# EasyEDA Pro project ProPrj_CH32V003-MAX4466_2025-10-29.epro

# Schematic Schematic1
Board Name: Board1; Create Date: 2025-10-22; Page Name: P1; Project Name: CH32V003-MAX4466; Schematic Name: Schematic1; Update Date: 2025-10-22; Company: 嘉立创EDA; Page Size: A4; Version: V1.0
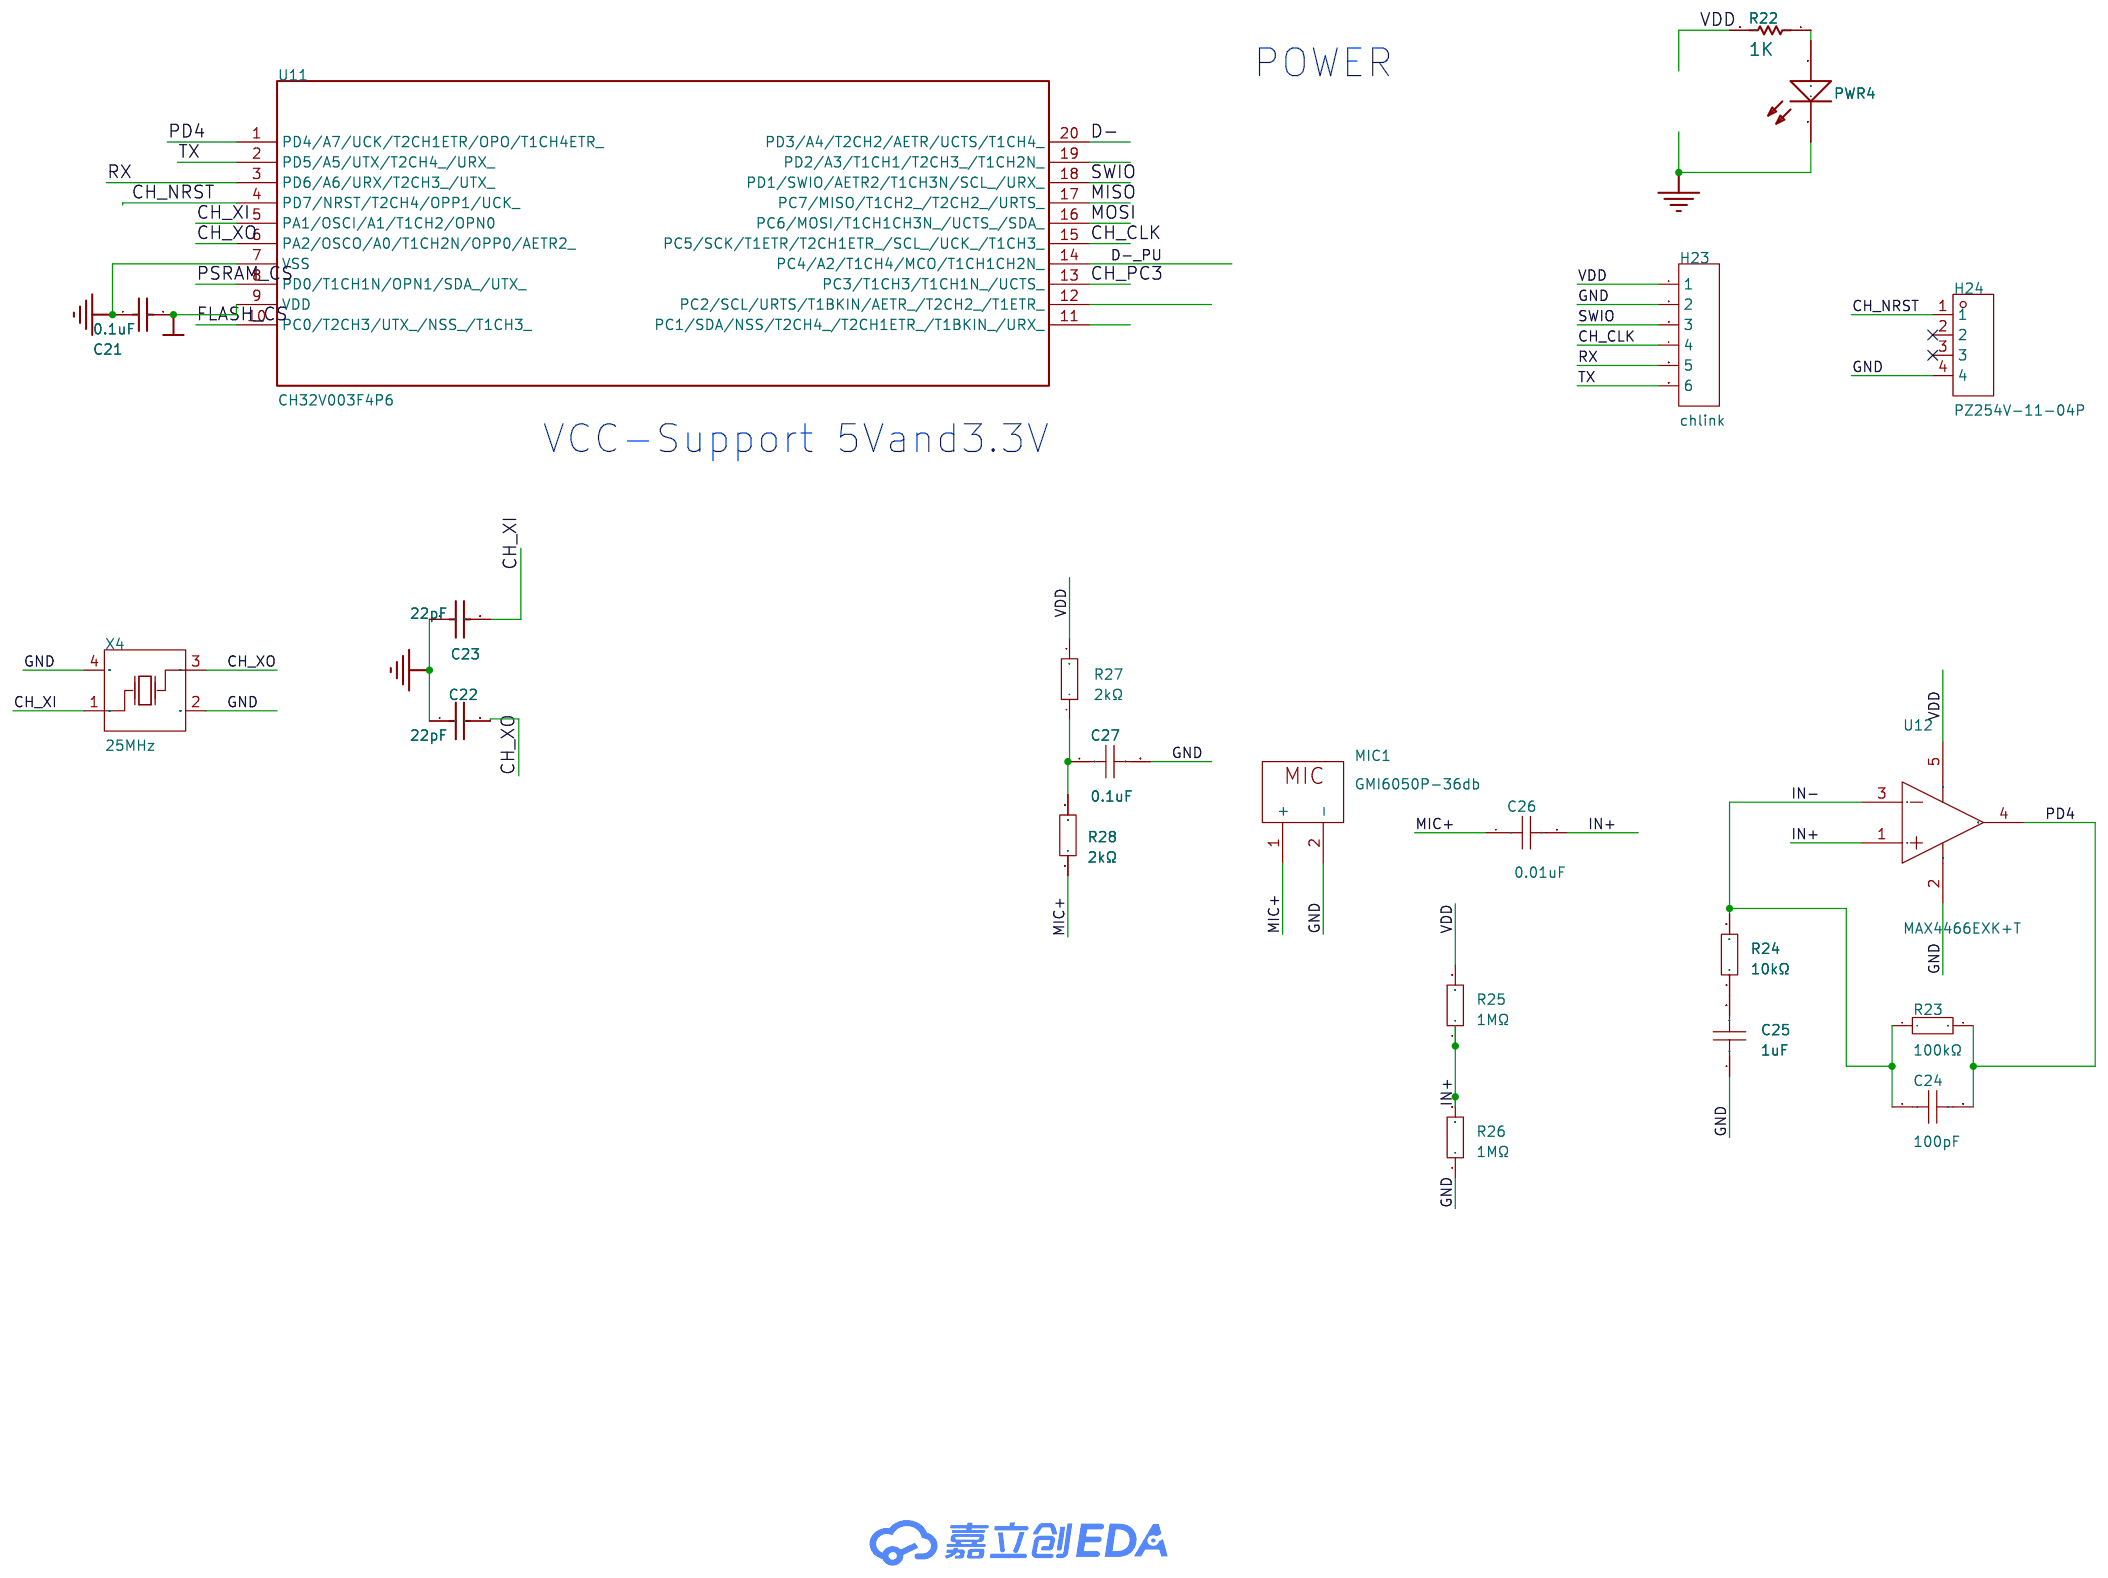
[diagram p0: schematic sheet]

## Parts
C21  15pF  [0603_C]
C22  22pF  [0603_C]
C23  22pF  [0603_C]
C24  100pF  [C0805]
C25  1uF  [C0805]
C26  0.01uF  [C0805]
C27  0.1uF  [C0805]
H23  chlink  [HDR-TH_6P-P2.54-V-M-1]
H24  PZ254V-11-04P  [HDR-TH_4P-P2.54-V-M]
MIC1  GMI6050P-36db  [MIC-TH_BD6.0-P1.90-D0.4-L-FD_GMI6050P-2CXXDB]
PWR4  POWER  red  [0603+]
R22  1K  [0603]
R23  100kΩ  [R0805]
R24  10kΩ  [R0805]
R25  1MΩ  [R0805]
R26  1MΩ  [R0805]
R27  2kΩ  [R0805]
R28  2kΩ  [R0805]
U11  CH32V003F4P6  [TSSOP-20_L6.5-W4.4-P0.65-LS6.4-BL]
U12  MAX4466EXK+T  [SC-70-5_L2.0-W1.3-P0.65-LS2.1-BR]
X4  25MHz  [CRYSTAL-SMD_4P-L3.2-W2.5-BL]

## Library data of the parts
C21 = 0.1uF: Capacitor; Published: 8-Jun-2000; LatestRevisionDate: 17-Jul-2002; LatestRevisionNote: Re-released for DXP Platform.; PackageReference: RAD-0.3; Publisher: Altium Limited; Design Item ID: Cap; Library Name: *
C22 C23 = 22pF: Capacitor; Design Item ID: CAP; Library Name: *
C24-C27 = CL21A106KAYNNNE_C15850: 容值:10uF;精度:±10%;额定电压:25V;温度系数:X5R;; LCSC Part Name: 10uF ±10% 25V; Supplier Part: C15850; Manufacturer: SAMSUNG(三星); Manufacturer Part: CL21A106KAYNNNE; Supplier Footprint: 0805; JLCPCB Part Class: 基础库; Datasheet: https://item.szlcsc.com/datasheet/CL21A106KAYNNNE/16532.html; Supplier: LCSC; Tolerance: ±10%; Voltage Rating: 25V; Temperature Coefficient: X5R
H23 = 2.54-1x6P直针: 插针结构:1x6P;间距:2.54mm;行距:-;圆针/方针:方针;安装方式:直插;排数:单排;总PIN位数:6P;额定电流:3A;额定电压:-;配合针长度:-;塑高:-;触头材质:黄铜;触头镀层:-;工作温度:-40℃~+105℃;颜色:黑色;; LCSC Part Name: 1x6P 间距:2.54mm 方针 直插; Supplier Part: C37208; Manufacturer: BOOMELE(博穆精密); Supplier Footprint: 插件,P=2.54mm; JLCPCB Part Class: 扩展库; Datasheet: https://atta.szlcsc.com/upload/public/pdf/source/20250115/42A019761A40C8B839643401D8CA5A96.pdf; Supplier: LCSC; Pin Structure: 1x6P; Pitch: 2.54mm; Circluar Pins/Square Pins: 方针; Mounting Type: 直插; Number of Rows: 单排; Number of Pins: 6P; Current Rating: 3A; Contact Material: 黄铜; Operating Temperature: -40℃~+105℃; Color: 黑色
H24 = PZ254V-11-04P: 插针结构:1x4P;间距:2.54mm;行距:-;圆针/方针:方针;安装方式:直插;排数:单排;总PIN位数:4P;额定电流:3A;额定电压:250V;配合针长度:6mm;塑高:2.5mm;端接针长度:3mm;触头材质:-;工作温度:-40℃~+105℃;颜色:黑色;; LCSC Part Name: 1x4P 间距:2.54mm 方针 直插; Supplier Part: C2691448; Manufacturer: XFCN(兴飞); Supplier Footprint: 插件,P=2.54mm; JLCPCB Part Class: 扩展库; Datasheet: https://item.szlcsc.com/datasheet/PZ254V-11-04P/2801085.html; Supplier: LCSC; Pin Structure: 1x4P; Pitch: 2.54mm; Circluar Pins/Square Pins: 方针; Mounting Type: 直插; Number of Rows: 单排; Number of Pins: 4P; Current Rating: 3A; Voltage Rating (Max): 250V; Length of Mating Pin: 6mm; Insulation Height: 2.5mm; Length of End Connection Pin: 3mm; Operating Temperature: -40℃~+105℃; Color: 黑色
MIC1 = GMI6050P-36db: LCSC Part Name: 全指向φ6.0*5.0mm 1.5V-10V 灵敏度-36db 低阻抗 针脚; Supplier Part: C233939; Manufacturer: INGHAi(赢海); Supplier Footprint: 插件,D=6mm; JLCPCB Part Class: 扩展库; Datasheet: https://atta.szlcsc.com/upload/public/pdf/source/20180613/C233951_CF3F103FE3546E5F8FCD1BC0597FF08F.pdf; Supplier: LCSC
PWR4 = POWER  red: Typical INFRARED GaAs LED; Published: 8-Jun-2000; LatestRevisionDate: 08-Jul-2005; LatestRevisionNote: Mech Layer 1 removed.; PackageReference: LED-0; Publisher: Altium Limited; Design Item ID: LED0; Library Name: *
R22 = 1K: Semiconductor Resistor; Published: 8-Jun-2000; LatestRevisionDate: 17-Jul-2002; LatestRevisionNote: Re-released for DXP Platform.; PackageReference: AXIAL-0.5; Publisher: Altium Limited; Origin Footprint 2: 1005[0402]; Origin Footprint 3: 1608[0603]; Origin Footprint 4: 2012[0805]; Design Item ID: Res Semi; Library Name: *
R23-R28 = 0805W8F1002T5E_C17414: 电阻类型:厚膜电阻;阻值:10kΩ;精度:±1%;功率:125mW;工作电压:150V;温度系数:±100ppm/℃;; LCSC Part Name: 10kΩ ±1% 125mW 厚膜电阻; Supplier Part: C17414; Manufacturer: UNI-ROYAL(厚声); Manufacturer Part: 0805W8F1002T5E; Supplier Footprint: 0805; JLCPCB Part Class: 基础库; Datasheet: https://atta.szlcsc.com/upload/public/pdf/source/20200306/C422600_1E6D84923E4A46A82E41ADD87F860B5C.pdf; Supplier: LCSC; Type: 厚膜电阻; Tolerance: ±1%; Power(Watts): 125mW; Voltage-Supply(Max): 150V; Temperature Coefficient: ±100ppm/℃; Operating Temperature: -55℃~+155℃
U11 = CH32V003F4P6: LCSC Part Name: QingKe V2微处理器; Supplier Part: C5187096; Manufacturer: WCH(南京沁恒); Supplier Footprint: TSSOP-20-175mil; JLCPCB Part Class: Extended Part; Datasheet: https://item.szlcsc.com/datasheet/CH32V003F4P6/5858783.html; Supplier: LCSC
U12 = MAX4466EXK+T: 功放类型:-;扬声器通道数:单声道;输出功率:-;静态电流(Iq):-;; LCSC Part Name: 低成本、微功耗、SC70/SOT23-8封装、麦克风前置放大器，可完全关断; Supplier Part: C7456762; Manufacturer: ADI(亚德诺)/MAXIM(美信); Supplier Footprint: SC-70-5; JLCPCB Part Class: 扩展库; Datasheet: https://item.szlcsc.com/datasheet/MAX4466EXK%252BT/8482791.html; Supplier: LCSC; Speaker Channels: 单声道; Voltage - Supply: 2.4V~5.5V; Operating Temperature: -40℃~+85℃
X4 = X322525MOB4SI: 晶振类型:贴片晶振;频率:25MHz;常温频差:±10ppm;负载电容:12pF;频率稳定度:±20ppm;; LCSC Part Name: YSX321SL 25MHZ 4P 3225 12PF ±10PPM -40~85℃ (±20PPM); Supplier Part: C9006; Manufacturer: YXC(扬兴晶振); Supplier Footprint: SMD3225-4P; JLCPCB Part Class: 基础库; Datasheet: https://atta.szlcsc.com/upload/public/pdf/source/20240329/19D5F850207469550BEB00D7DFEDBC7A.pdf; Supplier: LCSC; Type: 贴片晶振; Normal temperature Frequency Tolerance: ±10ppm; Load Capacitance: 12pF; Frequency Stability: ±20ppm; Operating Temperature: -40℃~+85℃

## Nets
GND: C21.1 C22.1 C23.1 C25.1 C27.2 H23.2 H24.4 MIC1.2(-) PWR4.2(K) R26.1 U11.7(VSS) U12.2(GND) X4.2(GND) X4.4(GND)
VDD: C21.2 H23.1 R22.2 R25.2 R27.2 U11.9(VDD) U12.5(VCC)
CH_CLK: H23.4 U11.15(PC5/SCK/T1ETR/T2CH1ETR_/SCL_/UCK_/T1CH3_)
CH_NRST: H24.1 U11.4(PD7/NRST/T2CH4/OPP1/UCK_)
CH_PC3: U11.13(PC3/T1CH3/T1CH1N_/UCTS_)
CH_XI: C23.2 U11.5(PA1/OSCI/A1/T1CH2/OPN0) X4.1(OSC1)
CH_XO: C22.2 U11.6(PA2/OSCO/A0/T1CH2N/OPP0/AETR2_) X4.3(OSC2)
D-: U11.20(PD3/A4/T2CH2/AETR/UCTS/T1CH4_)
D-_PU: U11.14(PC4/A2/T1CH4/MCO/T1CH1CH2N_)
FLASH_CS: U11.10(PC0/T2CH3/UTX_/NSS_/T1CH3_)
IN+: C26.2 R25.1 R26.2 U12.1(IN+)
IN-: C24.1 R23.1 R24.2 U12.3(IN-)
MIC+: C26.1 MIC1.1(+) R28.1
MISO: U11.17(PC7/MISO/T1CH2_/T2CH2_/URTS_)
MOSI: U11.16(PC6/MOSI/T1CH1CH3N_/UCTS_/SDA_)
PD4: C24.2 R23.2 U11.1(PD4/A7/UCK/T2CH1ETR/OPO/T1CH4ETR_) U12.4(OUT)
PSRAM_CS: U11.8(PD0/T1CH1N/OPN1/SDA_/UTX_)
RX: H23.5 U11.3(PD6/A6/URX/T2CH3_/UTX_)
SWIO: H23.3 U11.18(PD1/SWIO/AETR2/T1CH3N/SCL_/URX_)
TX: H23.6 U11.2(PD5/A5/UTX/T2CH4_/URX_)
$1N756: PWR4.1(A) R22.1
$1N1311: C25.2 R24.1
$1N1385: C27.1 R27.1 R28.2

Not connected (* = marked no-connect by the designer): H24 2* 3*; U11 11(PC1/SDA/NSS/T2CH4_/T2CH1ETR_/T1BKIN_/URX_) 12(PC2/SCL/URTS/T1BKIN/AETR_/T2CH2_/T1ETR_) 19(PD2/A3/T1CH1/T2CH3_/T1CH2N_)

## Notes on the sheet
- POWER
- VCC-Support 5Vand3.3V

# Board PCB1
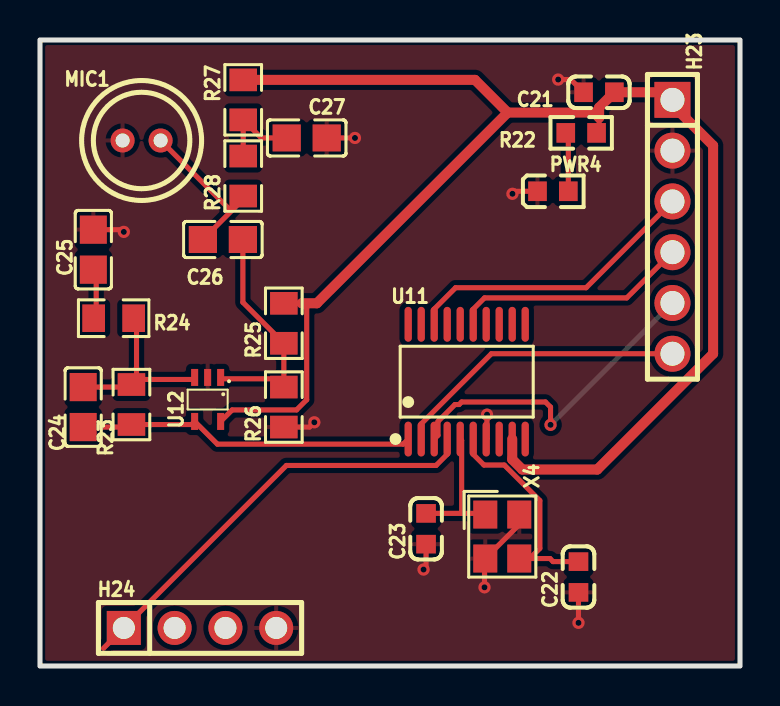
[diagram p1: board, top side]
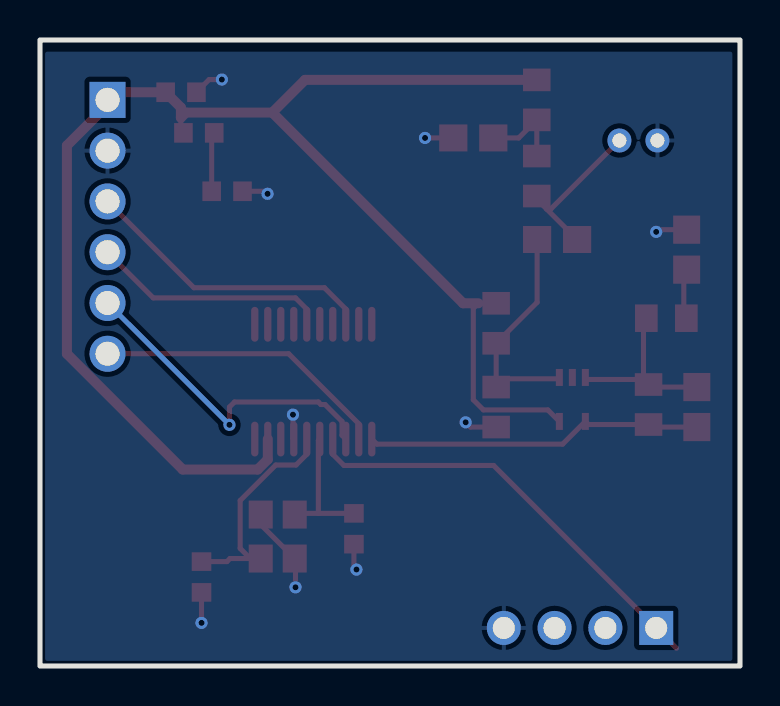
[diagram p2: board, bottom side, seen from below]

Outline 35 x 31.32 mm; copper layers: Top Layer, Bottom Layer. Coordinates in mm from the lower left corner of the outline.
Outline path: rectangle 0,31.32 35,0
Stack: Top Layer 0.035mm / Dielectric1 1.51mm FR4 er 4.5 / Bottom Layer 0.035mm

## Design rules (mm)
template: JLCPCB Capability(Two Layers Board)
spacing copperThickness1oz (default): track to track 0.102, other pairs 0.152 to 0.3
spacing copperThickness2oz: track to track 0.203, other pairs 0.152 to 0.3
track width copperThickness1oz (default): min 0.127, default 0.254, max 2.54
track width copperThickness2oz: min 0.203, default 0.254, max 2.54
differential pair differentialPair (default): width min 0.127, default 0.254, max 2.54; gap min 0.152, default 0.152
via viaSize (default): diameter min 0.5, default 0.61, max 10; hole min 0.3, default 0.305, max 6.3

## Placement (name value [footprint] x y rotation side)
C21  15pF  [0603_C]  27.18 28.7 0 top
C22  22pF  [0603_C]  26.92 3.68 90 top
C23  22pF  [0603_C]  19.3 6.1 90 top
C24  100pF  [C0805]  2.16 12.95 270 top
C25  1uF  [C0805]  2.67 20.83 270 top
C26  0.01uF  [C0805]  9.14 21.34 0 top
C27  0.1uF  [C0805]  13.33 26.42 0 top
H23  chlink  [HDR-TH_6P-P2.54-V-M-1]  31.62 21.97 270 top
H24  PZ254V-11-04P  [HDR-TH_4P-P2.54-V-M]  8 1.91 0 top
MIC1  GMI6050P-36db  [MIC-TH_BD6.0-P1.90-D0.4-L-FD_GMI6050P-2CXXDB]  5.08 26.29 180 top
PWR4  POWER  red  [0603+]  26.42 23.75 180 top
R22  1K  [0603]  26.29 26.67 0 top
R23  100kΩ  [R0805]  4.57 13.08 270 top
R24  10kΩ  [R0805]  3.68 17.4 0 top
R25  1MΩ  [R0805]  12.19 17.15 90 top
R26  1MΩ  [R0805]  12.19 12.95 90 top
R27  2kΩ  [R0805]  10.16 28.32 90 top
R28  2kΩ  [R0805]  10.16 24.51 90 top
U11  CH32V003F4P6  [TSSOP-20_L6.5-W4.4-P0.65-LS6.4-BL]  21.34 14.22 0 top
U12  MAX4466EXK+T  [SC-70-5_L2.0-W1.3-P0.65-LS2.1-BR]  8.38 13.34 90 top
X4  25MHz  [CRYSTAL-SMD_4P-L3.2-W2.5-BL]  23.11 6.48 270 top

## Footprints (pads in the part's own frame, mm; a bottom-side part is the same pattern mirrored in y, then rotated)
0603
  rect 0.93x0.98 smd: 1(0,0) 2(1.54,0)
0603+
  rect 0.93x0.98 smd: 1(0,0) 2(1.54,0)
0603_C
  rect 0.93x0.98 smd: 1(0,0) 2(1.54,0)
C0805
  rect 1.41x1.35 smd: 1(-1,0) 2(1,0)
CRYSTAL-SMD_4P-L3.2-W2.5-BL
  rect 1.4x1.2 smd: 1(-1.1,-0.85) 2(1.1,-0.85) 3(1.1,0.85) 4(-1.1,0.85)
HDR-TH_4P-P2.54-V-M
  rect 1.7x1.7 hole 1.1: 1(-3.81,0)
  round 1.7 hole 1.1: 2(-1.27,0) 3(1.27,0) 4(3.81,0)
HDR-TH_6P-P2.54-V-M-1
  rect 1.8x1.8 hole 1.2: 1(-6.35,0)
  round 1.8 hole 1.2: 2(-3.81,0) 3(-1.27,0) 4(1.27,0) 5(3.81,0) 6(6.35,0)
MIC-TH_BD6.0-P1.90-D0.4-L-FD_GMI6050P-2CXXDB
  round 1.2 hole 0.7: 1(-0.95,0) 2(0.95,0)
R0805
  rect 1.133x1.377 smd: 1(-1,0) 2(1,0)
SC-70-5_L2.0-W1.3-P0.65-LS2.1-BR
  rect 0.85x0.35 smd: 1(1.1,-0.65) 2(1.1,0) 3(1.1,0.65) 4(-1.1,0.65) 5(-1.1,-0.65)
TSSOP-20_L6.5-W4.4-P0.65-LS6.4-BL
  oval 0.364x1.742 smd: 1(-2.925,-2.871) 2(-2.275,-2.871) 3(-1.625,-2.871) 4(-0.975,-2.871) 5(-0.325,-2.871) 6(0.325,-2.871) 7(0.975,-2.871) 8(1.625,-2.871) 9(2.275,-2.871) 10(2.925,-2.871) 11(2.925,2.871) 12(2.275,2.871) 13(1.625,2.871) 14(0.975,2.871) 15(0.325,2.871) 16(-0.325,2.871) 17(-0.975,2.871) 18(-1.625,2.871) 19(-2.275,2.871) 20(-2.925,2.871)

## Nets
As in the schematic.

Pads without a net: H24 2 3

## Via types
v1: diameter 0.61, hole 0.305, Top Layer to Bottom Layer, 10 vias

## Routing (per net, layer and track width the routed paths; a pad name or vN(x,y) marks a point on that pad's centre or on a via; arc(x,y) is an arc through that point)
GND: length 15.9
  Top Layer w0.254: v1(22.35,12.57) 22.35,11.39 U11.7 ; R26.1 13.48,11.95 v1(13.72,12.19) ; v1(25.91,29.34) 26.54,29.34 C21.1 ; v1(23.62,23.62) 23.75,23.75 PWR4.2 ; v1(4.19,21.72) 4.08,21.83 C25.1 ; C23.1 19.3,4.95 v1(19.18,4.83) ; C22.1 v1(26.92,2.16) ; v1(22.22,3.94) 22.22,5.34 X4.2 23.96,7.08 X4.4 ; C27.2 v1(15.75,26.42)
VDD: length 76.1
  Top Layer w0.254: 27.96,27.43 27.96,26.8 R22.2 ; R25.2 13.08,18.15 13.33,17.89 13.33,13.32 12.83,12.81 9.61,12.81 U12.5
  Top Layer w0.5: 23.38,27.69 21.75,29.32 R27.2 ; 23.38,27.69 27.7,27.69 27.96,27.43 27.96,27.94 C21.2 31.24,28.7 H23.1 31.62,28.07 33.66,26.04 33.66,15.62 27.86,9.83 24.12,9.83 23.61,10.33 U11.9 ; 23.38,27.69 13.84,18.15 13.08,18.15
CH_CLK: length 11.9
  Top Layer w0.254: 21.66,17.1 21.66,17.85 22.22,18.42 29.34,18.42 H23.4
CH_NRST: length 22
  Top Layer w0.254: U11.4 20.36,10.59 19.8,10.03 12.32,10.03 H24.1 3.17,0.89
CH_XI: length 6.7
  Top Layer w0.254: C23.2 21.08,7.64 ; 21.08,7.64 21.08,11.28 U11.5 ; 21.08,7.64 22.2,7.64 X4.1
CH_XO: length 11.2
  Top Layer w0.254: 24.48,5.38 25.5,5.38 25.65,5.22 C22.2 ; 24.48,5.38 24.99,5.89 24.99,8.28 23.21,10.05 22.2,10.05 21.66,10.59 21.66,11.35 ; 24.48,5.38 X4.3
IN+: length 11.4
  Top Layer w0.254: C26.2 10.14,18.19 R25.1 12.19,14.37 ; 12.19,14.37 R26.2 ; 12.19,14.37 9.1,14.37 U12.1
IN-: length 8.9
  Top Layer w0.254: 4.83,14.34 R23.1 4.44,13.95 C24.1 ; 4.83,14.34 7.63,14.34 U12.3 ; 4.83,14.34 4.83,17.26 R24.2
MIC+: length 8.1
  Top Layer w0.254: R28.1 10.16,23.35 9.67,22.86 ; 9.67,22.86 9.46,22.86 MIC1.1 ; 9.67,22.86 C26.1
PD4: length 16.9
  Top Layer w0.254: C24.2 4.44,11.95 R23.2 7.58,12.08 U12.4 8.87,11.1 18.16,11.1 U11.1
RX: length 16.6
  Top Layer w0.254: U11.3 19.9,11.54 19.9,12.23 20.75,13.08 20.95,13.08 21.08,13.21 25.27,13.21 25.53,12.95 v1(25.53,12.07)
  Bottom Layer w0.254: H23.5 v1(25.53,12.07)
SWIO: length 14.9
  Top Layer w0.254: H23.3 27.3,18.92 20.78,18.92 19.71,17.86 U11.18
TX: length 14.8
  Top Layer w0.254: H23.6 22.57,15.62 19.06,12.12 U11.2
$1N756: length 3
  Top Layer w0.254: R22.1 26.42,26.54 PWR4.1
$1N1311: length 2.6
  Top Layer w0.254: C25.2 2.79,19.83 2.81,19.81 2.81,17.53 R24.1
$1N1385: length 4.4
  Top Layer w0.254: C27.1 11.06,26.42 R27.1 R28.2

## Copper pours and planes (outline as drawn; the poured copper is in the pictures)
GND on Top Layer: 0.13,31.12 35,31.12 35,-3.68 0.13,-3.68
GND on Bottom Layer: 0.38,30.73 35,30.73 35,-3.68 0.38,-3.68
